# Altium schematic sheet Page 08-Strap&LEDs.SchDoc
size 416 x 264 mm; DocumentNumber: 8; SheetNumber: 8; PageSetup: Record=PageOptions|CenterHorizontal=True|CenterVertical=True|PrintScale=1.02|XCorrection=1.00|YCorrection=1.00|PrintKind=0|BorderSize=5000000|LeftOffset=0|BottomOffset=0|Orientation=2|PaperLength=1000|PaperWidth=1000|Scale=100|PaperSource=15|PrintQuality=600|MediaType=1|DitherType=10|PrintScaleMode=1|PaperKind=11x17|PaperIndex=17; Designer: Xuelu Li; DocumentFullPathAndName: //depot_np_hweng_boards/ung_hweng/UNG_8017_EVB-USB5926/
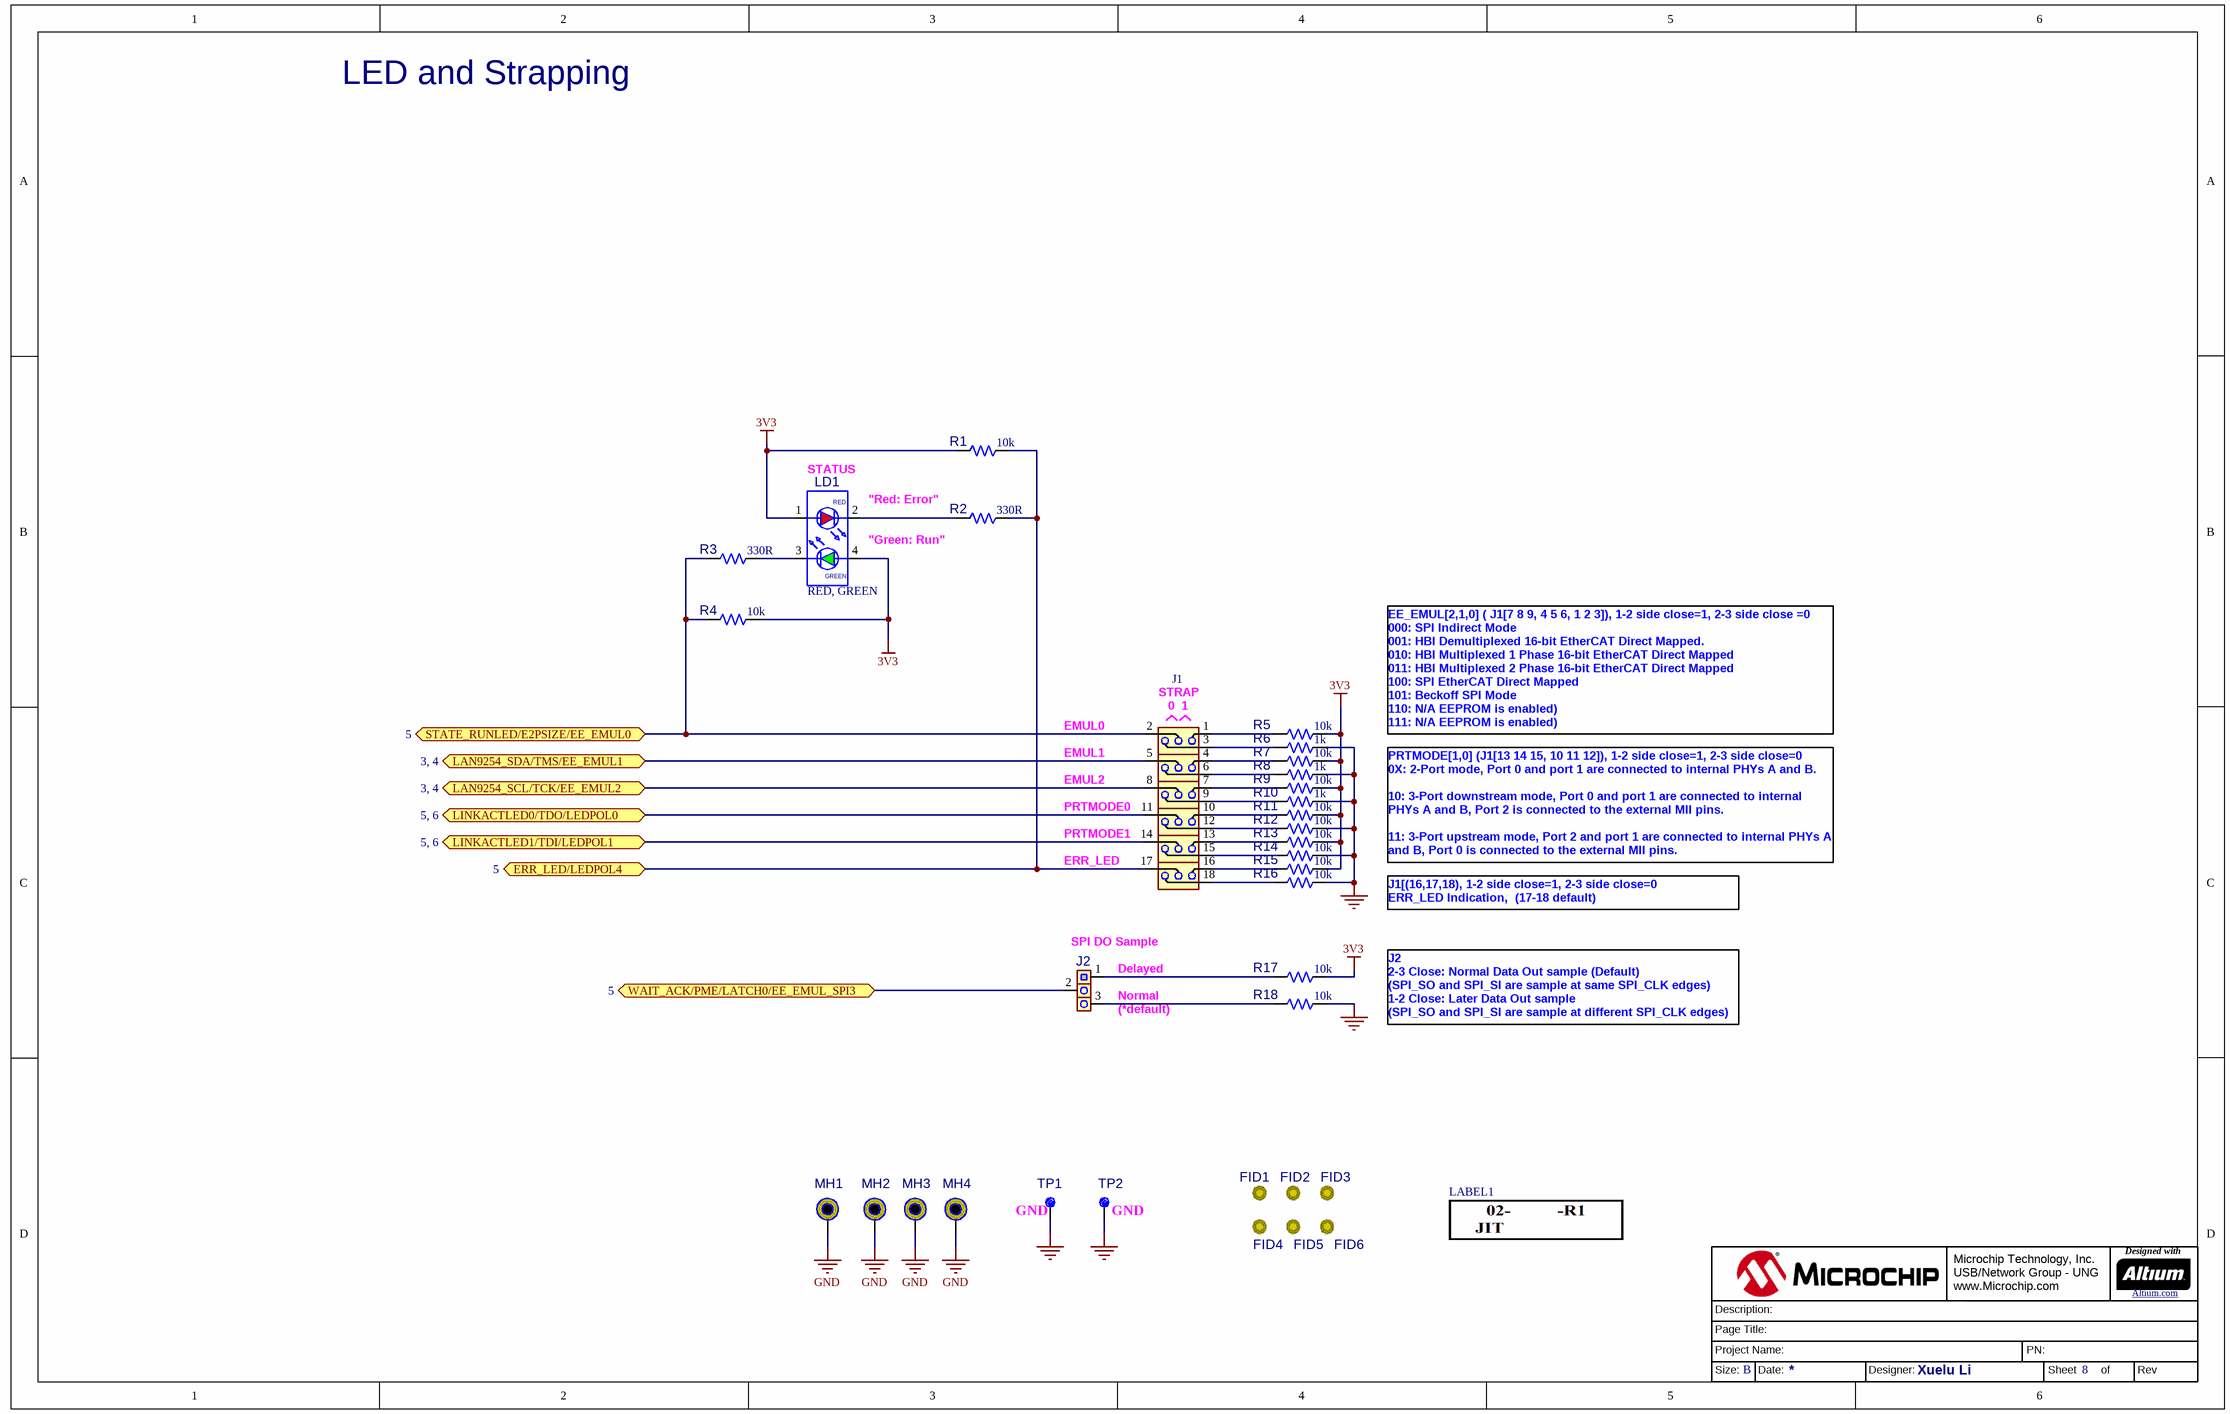
[diagram p0: Page 08-Strap&LEDs.SchDoc]

## Parts
?  (no value)  (graphical)
FID1  FIDUCIAL  [FIDUCIAL]  (value not drawn)  (no BOM)
FID2  FIDUCIAL  [FIDUCIAL]  (value not drawn)  (no BOM)
FID3  FIDUCIAL  [FIDUCIAL]  (value not drawn)  (no BOM)
FID4  FIDUCIAL  [FIDUCIAL]  (value not drawn)  (no BOM)
FID5  FIDUCIAL  [FIDUCIAL]  (value not drawn)  (no BOM)
FID6  FIDUCIAL  [FIDUCIAL]  (value not drawn)  (no BOM)
J1  Header 3X6  [HDR_M_2.54_3X6]  (value not drawn)
J2  Header 1x3  [HDR_M_2.54_1x3]  (value not drawn)
LABEL1  LABEL_Need_Help_Small  [LABEL_Need_Help_Small]  (value not drawn)
LD1  value RED, GREEN  [LED_DUAL_SMD_2x1.25mm]  (hidden comment: LED DUAL 4 pin)
MH1  MTHOLE 4-40 120DL 220PAD  [MTHOLE_4-40]  (value not drawn)  (no BOM)
MH2  MTHOLE 4-40 120DL 220PAD  [MTHOLE_4-40]  (value not drawn)  (no BOM)
MH3  MTHOLE 4-40 120DL 220PAD  [MTHOLE_4-40]  (value not drawn)  (no BOM)
MH4  MTHOLE 4-40 120DL 220PAD  [MTHOLE_4-40]  (value not drawn)  (no BOM)
R1  value 10k  [RES_C_0603]  (hidden comment: Resistor)
R2  value 330R  [RES_C_0603]  (hidden comment: Resistor)
R3  value 330R  [RES_C_0603]  (hidden comment: Resistor)
R4  value 10k  [RES_C_0603]  (hidden comment: Resistor)
R5  value 10k  [RES_C_0603]  (hidden comment: Resistor)
R6  value 1k  [RES_C_0603]  (hidden comment: Resistor)
R7  value 10k  [RES_C_0603]  (hidden comment: Resistor)
R8  value 1k  [RES_C_0603]  (hidden comment: Resistor)
R9  value 10k  [RES_C_0603]  (hidden comment: Resistor)
R10  value 1k  [RES_C_0603]  (hidden comment: Resistor)
R11  value 10k  [RES_C_0603]  (hidden comment: Resistor)
R12  value 10k  [RES_C_0603]  (hidden comment: Resistor)
R13  value 10k  [RES_C_0603]  (hidden comment: Resistor)
R14  value 10k  [RES_C_0603]  (hidden comment: Resistor)
R15  value 10k  [RES_C_0603]  (hidden comment: Resistor)
R16  value 10k  [RES_C_0603]  (hidden comment: Resistor)
R17  value 10k  [RES_C_0603]  (hidden comment: Resistor)
R18  value 10k  [RES_C_0603]  (hidden comment: Resistor)
TP1  Test Point  [CON_TP_TH_V_BLK_KEC_5001]  (value not drawn)
TP2  Test Point  [CON_TP_TH_V_BLK_KEC_5001]  (value not drawn)

## Ports
ERR_LED/LEDPOL4 (bidir, see 5), LAN9254_SCL/TCK/EE_EMUL2 (bidir, see 3, 4), LAN9254_SDA/TMS/EE_EMUL1 (bidir, see 3, 4), LINKACTLED0/TDO/LEDPOL0 (bidir, see 5, 6), LINKACTLED1/TDI/LEDPOL1 (bidir, see 5, 6), STATE_RUNLED/E2PSIZE/EE_EMUL0 (bidir, see 5), WAIT_ACK/PME/LATCH0/EE_EMUL_SPI3 (bidir, see 5)

## Nets
3V3: LD1.1(A1) LD1.4(A2) R1.1 R4.2 R5.1 R7.1 R9.1 R11.1 R13.1 R15.1 R17.1
GND: MH1.1 MH2.1 MH3.1 MH4.1 R6.2 R8.2 R10.2 R12.1 R14.1 R16.1 R18.1 TP1.1 TP2.1
ERR_LED/LEDPOL4: J1.17 R1.2 R2.2 ; port ERR_LED/LEDPOL4
LAN9254_SCL/TCK/EE_EMUL2: J1.8 ; port LAN9254_SCL/TCK/EE_EMUL2
LAN9254_SDA/TMS/EE_EMUL1: J1.5 ; port LAN9254_SDA/TMS/EE_EMUL1
LINKACTLED0/TDO/LEDPOL0: J1.11 ; port LINKACTLED0/TDO/LEDPOL0
LINKACTLED1/TDI/LEDPOL1: J1.14 ; port LINKACTLED1/TDI/LEDPOL1
STATE_RUNLED/E2PSIZE/EE_EMUL0: J1.2 R3.1 R4.1 ; port STATE_RUNLED/E2PSIZE/EE_EMUL0
WAIT_ACK/PME/LATCH0/EE_EMUL_SPI3: J2.2 ; port WAIT_ACK/PME/LATCH0/EE_EMUL_SPI3
NetJ1_1: J1.1 R5.2
NetJ1_3: J1.3 R6.1
NetJ1_4: J1.4 R7.2
NetJ1_6: J1.6 R8.1
NetJ1_7: J1.7 R9.2
NetJ1_9: J1.9 R10.1
NetJ1_10: J1.10 R11.2
NetJ1_12: J1.12 R12.2
NetJ1_13: J1.13 R13.2
NetJ1_15: J1.15 R14.2
NetJ1_16: J1.16 R15.2
NetJ1_18: J1.18 R16.2
NetJ2_1: J2.1 R17.2
NetJ2_3: J2.3 R18.2
NetLD1_2: LD1.2(K1) R2.1
NetLD1_3: LD1.3(K2) R3.2

## Notes on the sheet
- LED and Strapping
- (near LD1) STATUS
- "Red: Error"
- "Green: Run"
- EMUL0
- EMUL1
- (near J1) STRAP
- (near J1) 0
- (near J1) 1
- EE_EMUL[2,1,0] ( J1[7 8 9, 4 5 6, 1 2 3]), 1-2 side close=1, 2-3 side close =0
  000: SPI Indirect Mode
  001: HBI Demultiplexed 16-bit EtherCAT Direct Mapped.
  010: HBI Multiplexed 1 Phase 16-bit EtherCAT Direct Mapped
  011: HBI Multiplexed 2 Phase 16-bit EtherCAT Direct Mapped
  100: SPI EtherCAT Direct Mapped
  101: Beckoff SPI Mode
  110: N/A EEPROM is enabled)
  111: N/A EEPROM is enabled)
- EMUL2
- (near J1) PRTMODE0
- (near J1) ERR_LED
- (near J1) PRTMODE1
- PRTMODE[1,0] (J1[13 14 15, 10 11 12]), 1-2 side close=1, 2-3 side close=0
  0X: 2-Port mode, Port 0 and port 1 are connected to internal PHYs A and B.
  10: 3-Port downstream mode, Port 0 and port 1 are connected to internal PHYs A and B, Port 2 is connected to the external MII pins.
  11: 3-Port upstream mode, Port 2 and port 1 are connected to internal PHYs A and B, Port 0 is connected to the external MII pins.
- (near J2) SPI DO Sample
- J1[(16,17,18), 1-2 side close=1, 2-3 side close=0
  ERR_LED Indication,  (17-18 default)
- (near J2) Delayed
- (near J2) Normal
- (near J2) (*default)
- J2
  2-3 Close: Normal Data Out sample (Default)
  (SPI_SO and SPI_SI are sample at same SPI_CLK edges)
  1-2 Close: Later Data Out sample
  (SPI_SO and SPI_SI are sample at different SPI_CLK edges)
- (near TP1) GND
- (near TP2) GND
- Microchip Technology, Inc.
  USB/Network Group - UNG
  www.Microchip.com
- Designed with
- Altium.com <http://go.altium.com/MicrochipLandingPage_Evaluation.html>
- Page Title:
- Project Name:
- Description:
- PN:
- Size:
- B
- Date:
- Designer:
- Sheet
- of
- Rev
- (in symbol DIODE1110) RED; GREEN

## Library data of the parts
? = Title Block B_UNG1_Altium
FID1-FID6 = FIDUCIAL: Populated: DNP; Revision: 0; Description_: FIDUCIAL
J1 = MIC8078: Manufacturer 1: Digikey; Manufacturer Part Number 1: TSW-106-07-G-T; Value: HDR_M_2.54_3X6; Dev Tools Status: Design; Owner: Manikandan Balakrishnan; Populated: YES; MCHP-ID: MIC8078; Revision: A; Symbol: header 3x6; Description_: Header 3X6; Status: MCL Design; ComponentLink1URL: https://chn-vm-apps.microchip.com/mchprepo/parts/Datasheets/tsw-xxx-xx-xxx-x-xx-xxx-mkt; ComponentLink1Description: SVN Datasheet; ComponentLink2URL: C:\ALTIUM_WORK\00001_MCHP-CDB\Datasheets\tsw-xxx-xx-xxx-x-xx-xxx-mkt; ComponentLink2Description: Local Datasheet; ComponentLink3URL: C:\ALTIUM_WORK\00001_MCHP-CDB\Library\LibraryRefs\header 3x6.SchLib; ComponentLink3Description: Open Symbol; ComponentLink4URL: C:\ALTIUM_WORK\00001_MCHP-CDB\Library\Footprints\HDR_M_2.54_3X6.PcbLib; ComponentLink4Description: Open Footprint; ComponentLink5Description: Open Footprint 2; ComponentLink6Description: Open Footprint 3; ComponentLink7Description: Open Footprint 4; Type: Header 2.54mm; Category: Connector; Supplier 1: Digikey; Supplier Part Number 1: TSW-106-07-G-T-ND; Quantity Override: 1
J2 = CON0465: Manufacturer 1: Samtec; Manufacturer Part Number 1: TSW-103-07-T-S; Value: HDR-2.54 Male 1x3; Description_: CON HDR-2.54 Male 1x3 Tin 5.84MH TH VERT; Dev Tools Status: Production; Populated: Yes; MCHP-ID: CON0465; Revision: 1; Symbol: Header 1x3; Status: MCL Design; ComponentLink1URL: https://chn-vm-apps.microchip.com/mchprepo/parts/Datasheets/TSW-XXX-XX-XXX-X-XX-XXX-MKT.pdf; ComponentLink1Description: SVN Datasheet; ComponentLink2URL: C:\ALTIUM_WORK\00001_MCHP-CDB\Datasheets\TSW-XXX-XX-XXX-X-XX-XXX-MKT.pdf; ComponentLink2Description: Local Datasheet; ComponentLink3URL: C:\ALTIUM_WORK\00001_MCHP-CDB\Library\LibraryRefs\Header 1x3.SchLib; ComponentLink3Description: Open Symbol; ComponentLink4URL: C:\ALTIUM_WORK\00001_MCHP-CDB\Library\Footprints\HDR_M_2.54_1x3.PcbLib; ComponentLink4Description: Open Footprint; ComponentLink5Description: Open Footprint 2; ComponentLink6Description: Open Footprint 3; ComponentLink7Description: Open Footprint 4; Type: Header 2.54mm; Category: Connector; Manufacturer 2: SHENZHEN JUNHAO ENGINEERING; Manufacturer Part Number 2: R-211-0311-0021-000; Supplier 1: Digi-Key; Supplier Part Number 1: SAM1035-03-ND; Supplier 2: Raynen; Supplier Part Number 2: CONN00253B01; Quantity Override: 1
LABEL1 = 08-00028: Value: LABEL Need Help Small; Description_: LABEL, ASSY W/REV LEVEL (SMALL MODULES) PER MTS-0002; Dev Tools Status: Production; Populated: MECH; MCHP-ID: 08-00028; Revision: 6; Symbol: LABEL_Need_Help_Small; Status: MCL Design; ComponentLink1URL: https://chn-vm-apps.microchip.com/mchprepo/parts/Datasheets/08-00028R6.pdf; ComponentLink1Description: SVN Datasheet; ComponentLink2URL: C:\ALTIUM_WORK\00001_MCHP-CDB\Datasheets\08-00028R6.pdf; ComponentLink2Description: Local Datasheet; ComponentLink3URL: C:\ALTIUM_WORK\00001_MCHP-CDB\Library\LibraryRefs\LABEL_Need_Help_Small.SchLib; ComponentLink3Description: Open Symbol; ComponentLink4URL: C:\ALTIUM_WORK\00001_MCHP-CDB\Library\Footprints\LABEL_Need_Help_Small.PcbLib; ComponentLink4Description: Open Footprint; ComponentLink5Description: Open Footprint 2; ComponentLink6Description: Open Footprint 3; ComponentLink7Description: Open Footprint 4; Type: Small; Category: Label; Quantity Override: 1
LD1 = DIODE1110: LED; Manufacturer 1: Kingbright Corp; Manufacturer Part Number 1: APHBM2012SURKCGKC; Description_: DIO LED BI RED, GREEN 1.95V, 2.1V 30mA 0805; Dev Tools Status: Production; Type: LED Bicolor; Forward Current: 30mA; Power: 75mW; Reverse Current: 10uA; Owner: Bogdan P (M91398); Populated: Yes; MCHP-ID: DIODE1110; Revision: 0; Symbol: LED DUAL 4 PIN; Status: MCL Design; Package: 0805; ComponentLink1URL: https://chn-vm-apps.microchip.com/mchprepo/parts/Datasheets/APHBM2012SURKCGKC.pdf; ComponentLink1Description: SVN Datasheet; ComponentLink2URL: C:\ALTIUM_WORK\00001_MCHP-CDB\Datasheets\APHBM2012SURKCGKC.pdf; ComponentLink2Description: Local Datasheet; ComponentLink3URL: C:\ALTIUM_WORK\00001_MCHP-CDB\Library\LibraryRefs\LED DUAL 4 PIN.SchLib; ComponentLink3Description: Open Symbol; ComponentLink4URL: C:\ALTIUM_WORK\00001_MCHP-CDB\Library\Footprints\LED_DUAL_SMD_2x1.25mm.PcbLib; ComponentLink4Description: Open Footprint; ComponentLink5Description: Open Footprint 2; ComponentLink6Description: Open Footprint 3; ComponentLink7Description: Open Footprint 4; Operating Temperature: -40C to +85C; Category: Diode; Supplier 1: Digi-Key; Supplier Part Number 1: 754-1093-1-ND; Quantity Override: 1
MH1-MH4 = MTHOLE 4-40 120DL 220PAD: Populated: DNP; Revision: 0; Description_: MTHOLE 4-40 120DL 220PAD
R1 R4 R5 R7 R9 R11-R18 = RSMT0139: Manufacturer 1: Panasonic; Manufacturer Part Number 1: ERJ-3EKF1002V; Tolerance: 1%; Description_: RES TKF 10k 1% 1/10W SMD 0603; Dev Tools Status: Production; Temperature Coeffcient: 100ppm/C; Power: 1/10W; Populated: Yes; MCHP-ID: RSMT0139; Package: 0603; Revision: 2; Symbol: Resistor; Status: MCL Design; ComponentLink1URL: https://chn-vm-apps.microchip.com/mchprepo/parts/Datasheets/nrc.pdf; ComponentLink1Description: SVN Datasheet; ComponentLink2URL: C:\ALTIUM_WORK\00001_MCHP-CDB\Datasheets\nrc.pdf; ComponentLink2Description: Local Datasheet; ComponentLink3URL: C:\ALTIUM_WORK\00001_MCHP-CDB\Library\LibraryRefs\Resistor.SchLib; ComponentLink3Description: Open Symbol; ComponentLink4URL: C:\ALTIUM_WORK\00001_MCHP-CDB\Library\Footprints\RES_C_0603.PcbLib; ComponentLink4Description: Open Footprint; ComponentLink5Description: Open Footprint 2; ComponentLink6Description: Open Footprint 3; ComponentLink7Description: Open Footprint 4; Operating Temperature: -55C to +155C; Category: Resistor; Type: RES SMD; Composition: TKF; Manufacturer 2: Stackpole Electronics Inc; Manufacturer Part Number 2: RMCF0603FT10K0; Manufacturer 3: Yageo; Manufacturer Part Number 3: RC0603FR-0710KL; Manufacturer 4: Stackpole Electronics Inc; Manufacturer Part Number 4: RMCF 1/16 10K 1% R; Manufacturer 5: Xicon; Manufacturer Part Number 5: 302-10K-RC; Manufacturer 6: NIC Components; Manufacturer Part Number 6: NRC06F1002TRF; Supplier 1: Digi-Key; Supplier Part Number 1: P10.0KHCT-ND; Supplier 2: Digi-Key; Supplier Part Number 2: RMCF1/1610KFRTR-ND; Supplier 3: Digi-Key; Supplier Part Number 3: 311-10.0KHRCT-ND; Supplier 4: Digi-Key; Supplier Part Number 4: RMCF0603FT10K0TR-ND; Supplier 5: Mouser; Supplier Part Number 5: 302-10k-RC; Supplier 6: NIC Components; Supplier Part Number 6: NRC06F1002TRF; Quantity Override: 1
R2 R3 = RES0195: Manufacturer 1: ROHM; Manufacturer Part Number 1: MCR03EZPJ331; Tolerance: 5%; Description_: RES TKF 330R 5% 1/10W SMD 0603; Dev Tools Status: Production; Voltage: 50V; Temperature Coeffcient: 100ppm/C; Power: 1/10W; Populated: Yes; MCHP-ID: RES0195; Package: 0603; Revision: 1; Symbol: Resistor; Status: MCL Design; ComponentLink1URL: https://chn-vm-apps.microchip.com/mchprepo/parts/Datasheets/mcr_a.pdf; ComponentLink1Description: SVN Datasheet; ComponentLink2URL: C:\ALTIUM_WORK\00001_MCHP-CDB\Datasheets\mcr_a.pdf; ComponentLink2Description: Local Datasheet; ComponentLink3URL: C:\ALTIUM_WORK\00001_MCHP-CDB\Library\LibraryRefs\Resistor.SchLib; ComponentLink3Description: Open Symbol; ComponentLink4URL: C:\ALTIUM_WORK\00001_MCHP-CDB\Library\Footprints\RES_C_0603.PcbLib; ComponentLink4Description: Open Footprint; ComponentLink5Description: Open Footprint 2; ComponentLink6Description: Open Footprint 3; ComponentLink7Description: Open Footprint 4; Operating Temperature: -55C to +155C; Category: Resistor; Type: RES SMD; Composition: TKF; Manufacturer 2: Stackpole Electronics Inc; Manufacturer Part Number 2: RMCF0603JT330R; Manufacturer 3: Yageo; Manufacturer Part Number 3: 9C06031A3300JLHFT; Supplier 1: Digi-Key; Supplier Part Number 1: RHM330GCT-ND; Supplier 2: Digi-Key; Supplier Part Number 2: RMCF0603JT330RCT-ND; Supplier 3: Digi-Key; Supplier Part Number 3: 311-330GDKR-ND; Quantity Override: 1
R6 R8 R10 = RES1128: Manufacturer 1: Panasonic; Manufacturer Part Number 1: ERJ-3GEYJ102V; Tolerance: 5%; Description_: RES TKF 1k 5% 1/10W SMD 0603; Dev Tools Status: Production; Voltage: 75V; Temperature Coeffcient: 200ppm/C; Power: 1/10W; Owner: Bogdan P (M91398); Populated: Yes; MCHP-ID: RES1128; Package: 0603; Revision: 0; Symbol: Resistor; Status: MCL Design; ComponentLink1URL: https://chn-vm-apps.microchip.com/mchprepo/parts/Datasheets/AOA0000CE1.pdf; ComponentLink1Description: SVN Datasheet; ComponentLink2URL: C:\ALTIUM_WORK\00001_MCHP-CDB\Datasheets\AOA0000CE1.pdf; ComponentLink2Description: Local Datasheet; ComponentLink3URL: C:\ALTIUM_WORK\00001_MCHP-CDB\Library\LibraryRefs\Resistor.SchLib; ComponentLink3Description: Open Symbol; ComponentLink4URL: C:\ALTIUM_WORK\00001_MCHP-CDB\Library\Footprints\RES_C_0603.PcbLib; ComponentLink4Description: Open Footprint; ComponentLink5Description: Open Footprint 2; ComponentLink6Description: Open Footprint 3; ComponentLink7Description: Open Footprint 4; Operating Temperature: -55C to +155C; Category: Resistor; Type: RES SMD; Composition: TKF; Supplier 1: Digi-Key; Supplier Part Number 1: P1.0KGCT-ND; Quantity Override: 1
TP1 TP2 = MISC0026: Manufacturer 1: Keystone; Manufacturer Part Number 1: 5001; Value: TP LOOP Black; Description_: MISC, TEST POINT MULTI PURPOSE MINI BLACK; Dev Tools Status: Production; Owner: Stephen Humberd; Populated: YES; MCHP-ID: MISC0026; Revision: 0; Symbol: Test Point; Status: MCL Design; ComponentLink1URL: https://chn-vm-apps.microchip.com/mchprepo/parts/Datasheets/5000-5004.PDF; ComponentLink1Description: SVN Datasheet; ComponentLink2URL: C:\ALTIUM_WORK\00001_MCHP-CDB\Datasheets\5000-5004.PDF; ComponentLink2Description: Local Datasheet; ComponentLink3URL: C:\ALTIUM_WORK\00001_MCHP-CDB\Library\LibraryRefs\Test Point.SchLib; ComponentLink3Description: Open Symbol; ComponentLink4URL: C:\ALTIUM_WORK\00001_MCHP-CDB\Library\Footprints\CON_TP_TH_V_BLK_KEC_5001.PcbLib; ComponentLink4Description: Open Footprint; ComponentLink5Description: Open Footprint 2; ComponentLink6Description: Open Footprint 3; ComponentLink7Description: Open Footprint 4; Type: Test Point; Category: Connector; Supplier 1: Digi-Key; Supplier Part Number 1: 36-5001-ND; Quantity Override: 1